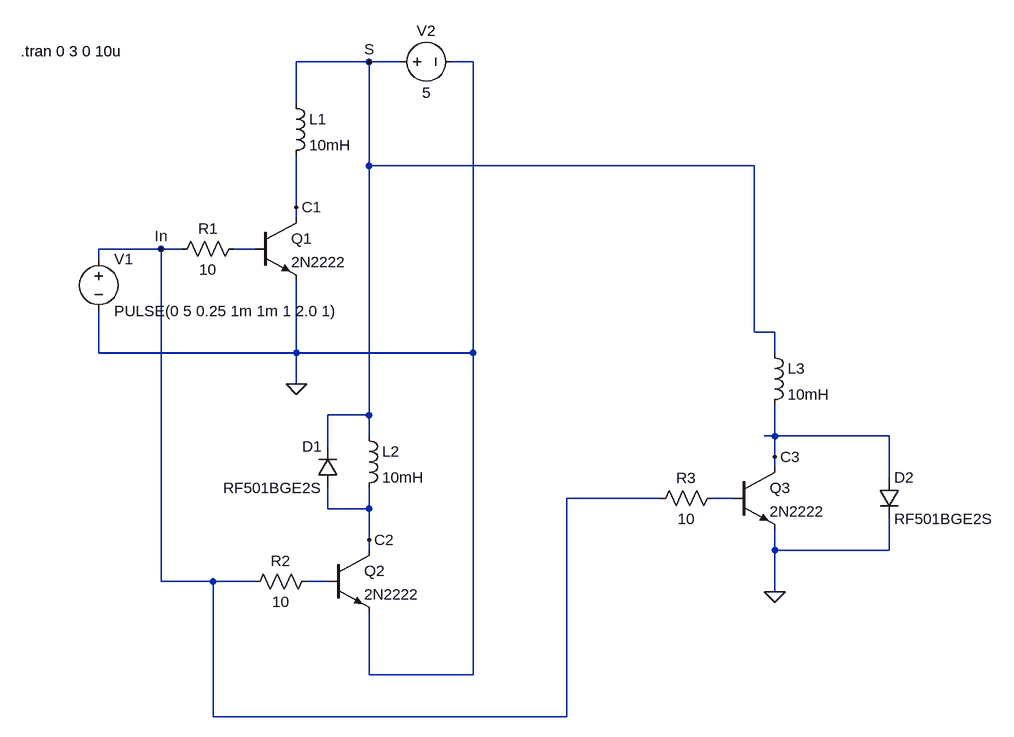
[diagram p0: schematic bjt_switch_solenoid.asc]
bjt_switch_solenoid.asc, the LTspice schematic file:
Version 4
SHEET 1 1240 1024
WIRE 288 0 176 0
WIRE 336 0 288 0
WIRE 448 0 416 0
WIRE 176 64 176 0
WIRE 288 160 288 0
WIRE 880 160 288 160
WIRE 176 224 176 144
WIRE 176 240 176 224
WIRE -32 288 -128 288
WIRE 0 288 -32 288
WIRE 112 288 80 288
WIRE -128 304 -128 288
WIRE 880 416 880 160
WIRE 912 416 880 416
WIRE -128 448 -128 384
WIRE 176 448 176 336
WIRE 176 448 -128 448
WIRE 448 448 448 0
WIRE 448 448 176 448
WIRE 912 448 912 416
WIRE 176 496 176 448
WIRE 288 544 288 160
WIRE 288 544 224 544
WIRE 288 576 288 544
WIRE 912 576 912 528
WIRE 912 576 896 576
WIRE 1088 576 912 576
WIRE 224 592 224 544
WIRE 912 608 912 576
WIRE 912 624 912 608
WIRE 1088 640 1088 576
WIRE 736 672 592 672
WIRE 848 672 816 672
WIRE 224 688 224 656
WIRE 288 688 288 656
WIRE 288 688 224 688
WIRE 288 736 288 688
WIRE 288 752 288 736
WIRE 912 752 912 720
WIRE 1088 752 1088 704
WIRE 1088 752 912 752
WIRE -32 800 -32 288
WIRE 48 800 -32 800
WIRE 112 800 48 800
WIRE 224 800 192 800
WIRE 912 816 912 752
WIRE 288 944 288 848
WIRE 448 944 448 448
WIRE 448 944 288 944
WIRE 48 1008 48 800
WIRE 592 1008 592 672
WIRE 592 1008 48 1008
FLAG 176 496 0
FLAG 176 224 C1
FLAG 288 736 C2
FLAG 288 0 S
FLAG -32 288 In
FLAG 912 608 C3
FLAG 912 816 0
SYMBOL npn 112 240 R0
SYMATTR InstName Q1
SYMATTR Value 2N2222
SYMBOL res -16 304 R270
WINDOW 0 32 56 VTop 2
WINDOW 3 0 56 VBottom 2
SYMATTR InstName R1
SYMATTR Value 10
SYMBOL voltage -128 288 R0
SYMATTR InstName V1
SYMATTR Value PULSE(0 5 0.25 1m 1m 1 2.0 1)
SYMBOL voltage 320 0 R270
WINDOW 0 32 56 VTop 2
WINDOW 3 -32 56 VBottom 2
SYMATTR InstName V2
SYMATTR Value 5
SYMBOL ind 160 48 R0
SYMATTR InstName L1
SYMATTR Value 10mH
SYMATTR SpiceLine Rser=100
SYMBOL npn 224 752 R0
SYMATTR InstName Q2
SYMATTR Value 2N2222
SYMBOL res 96 816 R270
WINDOW 0 32 56 VTop 2
WINDOW 3 0 56 VBottom 2
SYMATTR InstName R2
SYMATTR Value 10
SYMBOL ind 272 560 R0
SYMATTR InstName L2
SYMATTR Value 10mH
SYMATTR SpiceLine Rser=100
SYMBOL diode 240 656 R180
WINDOW 0 24 64 Left 2
WINDOW 3 24 0 Left 2
SYMATTR InstName D1
SYMATTR Value RF501BGE2S
SYMBOL npn 848 624 R0
SYMATTR InstName Q3
SYMATTR Value 2N2222
SYMBOL res 720 688 R270
WINDOW 0 32 56 VTop 2
WINDOW 3 0 56 VBottom 2
SYMATTR InstName R3
SYMATTR Value 10
SYMBOL ind 896 432 R0
SYMATTR InstName L3
SYMATTR Value 10mH
SYMATTR SpiceLine Rser=100
SYMBOL diode 1072 640 R0
SYMATTR InstName D2
SYMATTR Value RF501BGE2S
TEXT -248 -16 Left 2 !.tran 0 3 0 10u

The netlist it stands for:
* bjt_switch_solenoid.asc
Q1 C1 N001 0 0 2N2222
R1 In N001 10
V1 In 0 PULSE(0 5 0.25 1m 1m 1 2.0 1)
V2 S 0 5
L1 S C1 10mH Rser=100
Q2 C2 N003 0 0 2N2222
R2 In N003 10
L2 S C2 10mH Rser=100
D1 C2 S RF501BGE2S
Q3 C3 N002 0 0 2N2222
R3 In N002 10
L3 S C3 10mH Rser=100
D2 C3 0 RF501BGE2S
.model D D
.lib standard.dio
.model NPN NPN
.model PNP PNP
.lib standard.bjt
.tran 0 3 0 10u
.backanno
.end